# EAGLE schematic motor_driver (EAGLE 5.11)

## Sheet 1 of 2
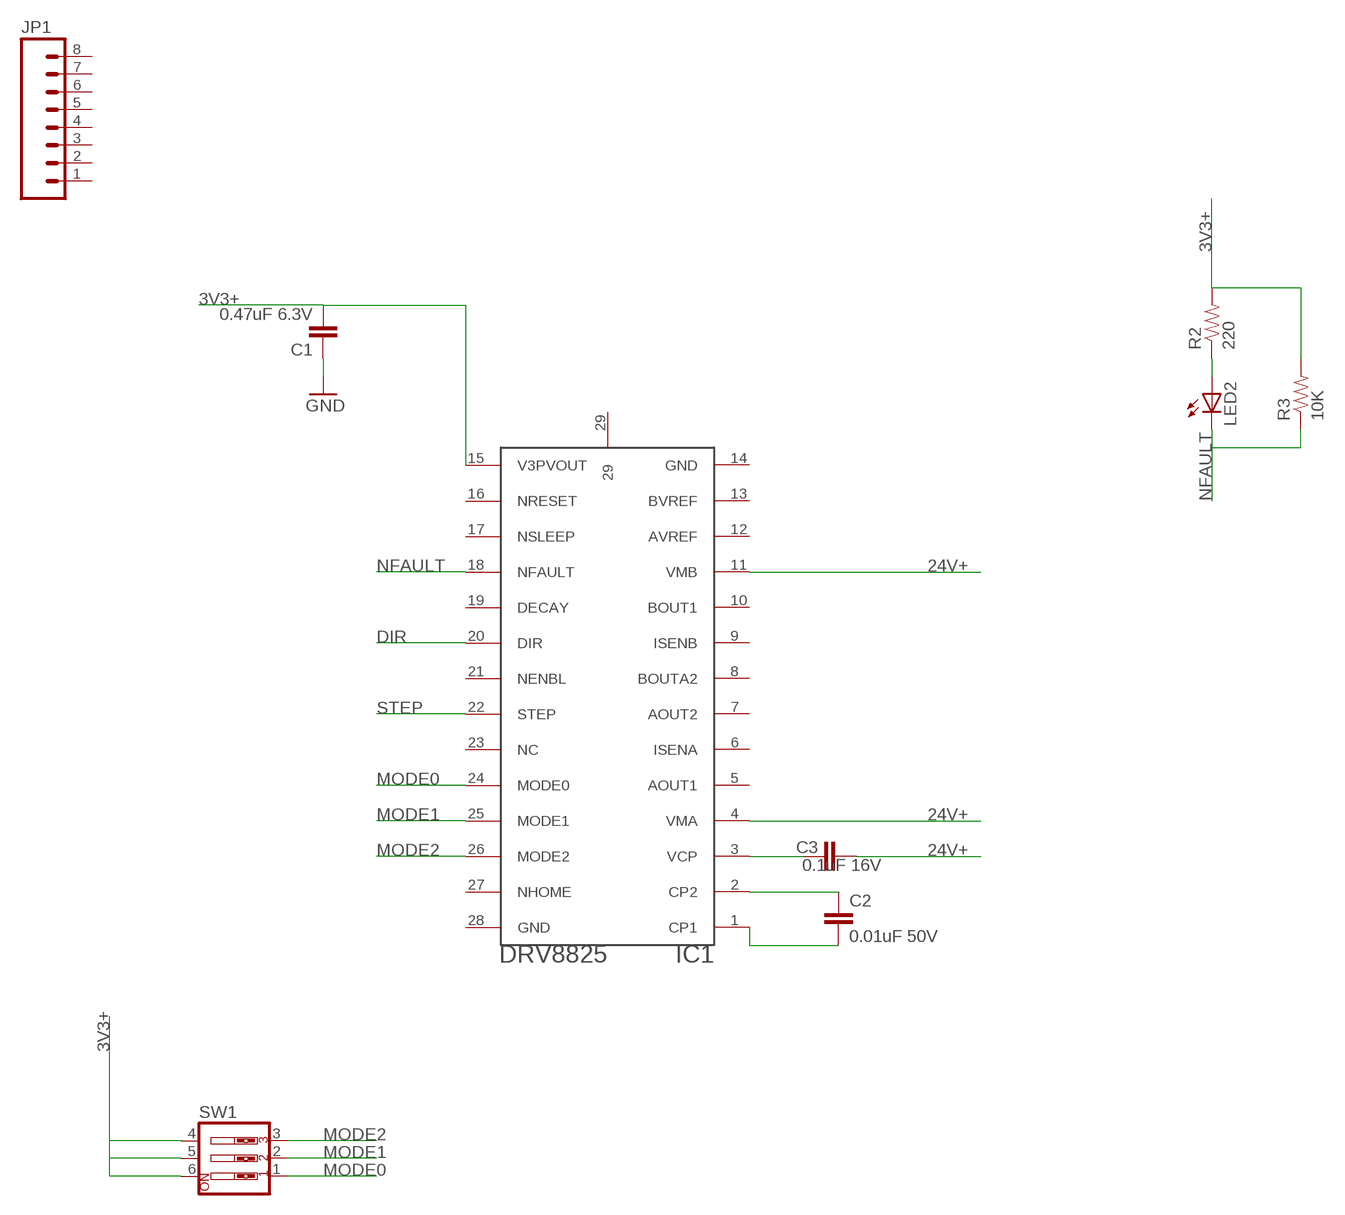
[diagram p0: schematic, sheet 1]

### Parts
C1  0.47uF 6.3V  CAP0805  [0805]
C2  0.01uF 50V  CAP0805  [0805]
C3  0.1uF 16V  CAP0805  [0805]
IC1  DRV8825  DRV8825TSSOP  [HTSSOP28]
JP1  M081X08  [1X08]
LED2  LEDCHIPLED_1206  [CHIPLED_1206]
R2  220  RESISTOR  [0805]
R3  10K  RESISTOR  [0805]
SW1  SW_DIP-3  [EDG-03]

### Nets
3V3+: C1.2 IC1.15(V3PVOUT) R2.2 R3.2 SW1.4 SW1.5 SW1.6
24V+: C3.2 IC1.4(VMA) IC1.11(VMB) ; also sheet 2
DIR: IC1.20(DIR)
GND: C1.1 ; also sheet 2
MODE0: IC1.24(MODE0) SW1.1
MODE1: IC1.25(MODE1) SW1.2
MODE2: IC1.26(MODE2) SW1.3
N$1: C2.1 IC1.2(CP2)
N$2: C2.2 IC1.1(CP1)
N$3: C3.1 IC1.3(VCP)
N$4: LED2.A R2.1
NFAULT: IC1.18(NFAULT) LED2.C R3.1
STEP: IC1.22(STEP)
Unconnected: IC1.5(AOUT1) IC1.6(ISENA) IC1.7(AOUT2) IC1.8(BOUTA2) IC1.9(ISENB) IC1.10(BOUT1) IC1.12(AVREF) IC1.13(BVREF) IC1.14(GND) IC1.16(NRESET) IC1.17(NSLEEP) IC1.19(DECAY) IC1.21(NENBL) IC1.23(NC) IC1.27(NHOME) IC1.28(GND) IC1.29 JP1.1 JP1.2 JP1.3 JP1.4 JP1.5 JP1.6 JP1.7 JP1.8

## Sheet 2 of 2
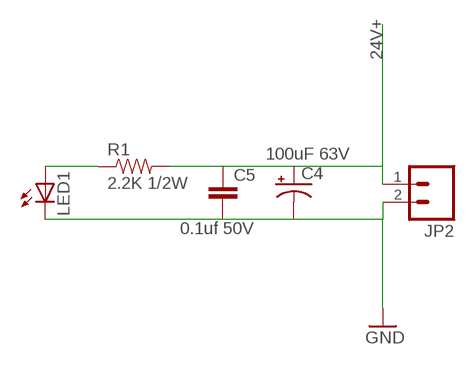
[diagram p1: schematic, sheet 2]

### Parts
C4  100uF 63V  CAP_POLG  [PANASONIC_G]
C5  0.1uf 50V  CAP0805  [0805]
JP2  M025MM  [SCREWTERMINAL-5MM-2]
LED1  LEDCHIPLED_1206  [CHIPLED_1206]
R1  2.2K 1/2W  RESISTOR1206  [1206]

### Nets
24V+: C4.+ C5.1 JP2.1 R1.2 ; also sheet 1
GND: C4.- C5.2 JP2.2 LED1.C ; also sheet 1
N$6: LED1.A R1.1

## Library data of the parts
C1-C3 C5 = SparkFun:CAP: Capacitor Standard 0603 ceramic capacitor, and 0.1" leaded capacitor.
C4 = SparkFun:CAP_POL: Capacitor Polarized These are standard SMD and PTH capacitors. Normally 10uF, 47uF, and 100uF in electrolytic and tantalum varieties. Always verify the external diameter of the through hole cap, it varies with capacity, voltage, and manufacturer. The EIA devices should be standard.
IC1 = motor_driver:DRV8825
JP1 = SparkFun:M08: Header 8 Standard 8-pin 0.1" header. Use with straight break away headers (SKU : PRT-00116), right angle break away headers (PRT-00553), swiss pins (PRT-00743), machine pins (PRT-00117), and female headers (PRT-00115).
JP2 = SparkFun:M02: Header 2 Standard 2-pin 0.1" header. Use with straight break away headers (SKU : PRT-00116), right angle break away headers (PRT-00553), swiss pins (PRT-00743), machine pins (PRT-00117), and female headers (PRT-00115). Molex polarized connector foot print use with SKU : PRT-08233 with associated crimp pins and housings.
LED1 LED2 = Prg_CPLD:LED: LED OSRAM: - CHIPLED LG R971, LG N971, LY N971, LG Q971, LY Q971, LO R971, LY R971 LH N974, LH R974 LS Q976, LO Q976, LY Q976 LO Q996 - Hyper CHIPLED LW Q18S LB Q993, LB Q99A, LB R99A - SideLED LS A670, LO A670, LY A670, LG A670, LP A670 LB A673, LV A673, LT A673, LW A673 LH A674 LY A675 LS A676, LA A676, LO A676, LY A676, LW A676 LS A679, LY A679, LG A679 - Hyper Micro SIDELED® LS Y876, LA Y876, LO Y876, LY Y876 LT Y87S - SmartLED LW L88C, LW L88S LB L89C, LB L89S, LG L890 LS L89K, LO L89K, LY L89K LS L896, LA L896, LO L896, LY L896 - TOPLED LS T670, LO T670, LY T670, LG T670, LP T670 LSG T670, LSP T670, LSY T670, LOP T670, LYG T670 LG T671, LOG T671, LSG T671 LB T673, LV T673, LT T673, LW T673 LH T674 LS T676, LA T676, LO T676, LY T676, LB T676, LH T676, LSB T676, LW T676 LB T67C, LV T67C, LT T67C, LS T67K, LO T67K, LY T67K, LW E67C LS E67B, LA E67B, LO E67B, LY E67B, LB E67C, LV E67C, LT E67C LW T67C LS T679, LY T679, LG T679 LS T770, LO T770, LY T770, LG T770, LP T770 LB T773, LV T773, LT T773, LW T773 LH T774 LS E675, LA E675, LY E675, LS T675 LS T776, LA T776, LO T776, LY T776, LB T776 LHGB T686 LT T68C, LB T68C - Hyper Mini TOPLED® LB M676 - Mini TOPLED Santana® LG M470 LS M47K, LO M47K, LY M47K Source: http://www.osram.convergy.de LUXEON: - LUMILED® LXK2-PW12-R00, LXK2-PW12-S00, LXK2-PW14-U00, LXK2-PW14-V00 LXK2-PM12-R00, LXK2-PM12-S00, LXK2-PM14-U00 LXK2-PE12-Q00, LXK2-PE12-R00, LXK2-PE12-S00, LXK2-PE14-T00, LXK2-PE14-U00 LXK2-PB12-K00, LXK2-PB12-L00, LXK2-PB12-M00, LXK2-PB14-N00, LXK2-PB14-P00, LXK2-PB14-Q00 LXK2-PR12-L00, LXK2-PR12-M00, LXK2-PR14-Q00, LXK2-PR14-R00 LXK2-PD12-Q00, LXK2-PD12-R00, LXK2-PD12-S00 LXK2-PH12-R00, LXK2-PH12-S00 LXK2-PL12-P00, LXK2-PL12-Q00, LXK2-PL12-R00 Source: www.luxeon.com KINGBRIGHT: KA-3528ASYC Source: www.kingbright.com
R1-R3 = Prg_CPLD:RESISTOR: Resistor Basic schematic elements and footprints for 0603, 1206, and PTH 1/10th watt (small) resistors.
SW1 = special:SW_DIP-3: DIP SWITCH